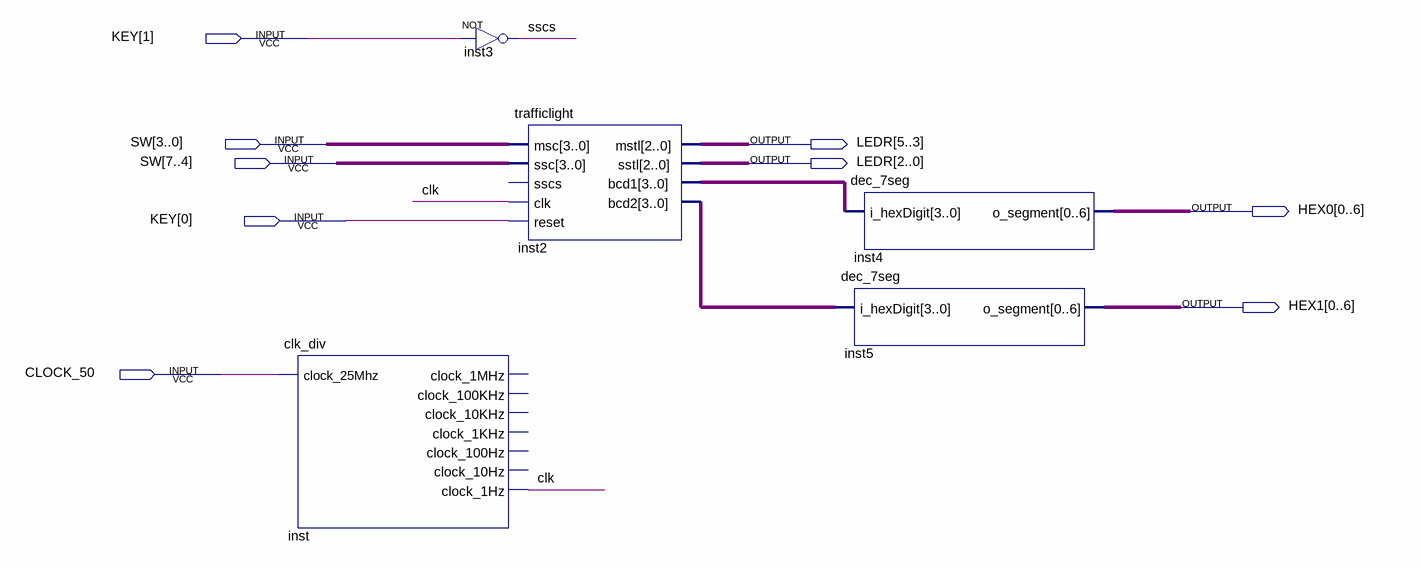
[diagram p0: schematic sheet]
// Quartus schematic BoardFile.bdf as structural Verilog: 5 symbols, 9 pins
module BoardFile (
  input  [1:0] KEY,
  input  [7:0] SW,
  input  CLOCK_50,
  output [5:0] LEDR,
  output [0:6] HEX0,
  output [0:6] HEX1
);

  wire clk, sscs;
  wire [3:0] inst2_bcd1, inst2_bcd2;

  clk_div inst (
    .clock_25Mhz(CLOCK_50), .clock_1Hz(clk));  // open: clock_1MHz, clock_100KHz, clock_10KHz, clock_1KHz, clock_100Hz, clock_10Hz
  not inst3 (sscs, KEY[1]);
  trafficlight inst2 (
    .msc(SW[3:0]), .ssc(SW[7:4]), .clk(clk), .reset(KEY[0]), .mstl(LEDR[5:3]), .sstl(LEDR[2:0]),
    .bcd1(inst2_bcd1), .bcd2(inst2_bcd2));  // open: sscs
  dec_7seg inst4 (.i_hexDigit(inst2_bcd1), .o_segment(HEX0));
  dec_7seg inst5 (.i_hexDigit(inst2_bcd2), .o_segment(HEX1));
endmodule
